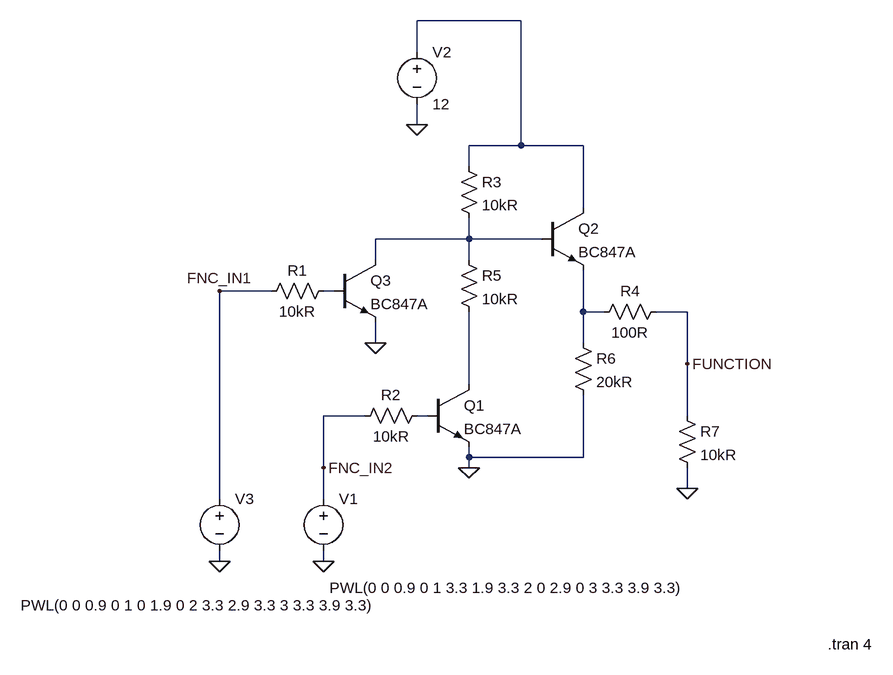
[diagram p0: schematic FUNCTION_output_circuit_ii.asc]
FUNCTION_output_circuit_ii.asc, the LTspice schematic file:
Version 4
SHEET 1 1620 784
WIRE 272 -192 112 -192
WIRE 112 -144 112 -192
WIRE 112 -32 112 -64
WIRE 272 0 272 -192
WIRE 272 0 192 0
WIRE 368 0 272 0
WIRE 192 32 192 0
WIRE 368 96 368 0
WIRE 192 144 192 112
WIRE 192 144 48 144
WIRE 304 144 192 144
WIRE 48 176 48 144
WIRE 192 176 192 144
WIRE -112 224 -192 224
WIRE -16 224 -32 224
WIRE 368 256 368 192
WIRE 400 256 368 256
WIRE 528 256 480 256
WIRE 48 304 48 272
WIRE 368 304 368 256
WIRE 528 336 528 256
WIRE 192 368 192 256
WIRE 32 416 -32 416
WIRE 128 416 112 416
WIRE 528 416 528 336
WIRE 192 480 192 464
WIRE 368 480 368 384
WIRE 368 480 192 480
WIRE -32 496 -32 416
WIRE 192 496 192 480
WIRE 528 528 528 496
WIRE -192 544 -192 224
WIRE -32 544 -32 496
WIRE -192 640 -192 624
WIRE -32 640 -32 624
FLAG 192 496 0
FLAG 112 -32 0
FLAG -192 224 FNC_IN1
FLAG -32 496 FNC_IN2
FLAG -192 640 0
FLAG -32 640 0
FLAG 528 336 FUNCTION
FLAG 528 528 0
FLAG 48 304 0
SYMBOL npn 128 368 R0
SYMATTR InstName Q1
SYMATTR Value BC847A
SYMBOL npn 304 96 R0
SYMATTR InstName Q2
SYMATTR Value BC847A
SYMBOL res -16 208 R90
WINDOW 0 0 56 VBottom 2
WINDOW 3 32 56 VTop 2
SYMATTR InstName R1
SYMATTR Value 10kR
SYMBOL res 128 400 R90
WINDOW 0 0 56 VBottom 2
WINDOW 3 32 56 VTop 2
SYMATTR InstName R2
SYMATTR Value 10kR
SYMBOL res 176 16 R0
SYMATTR InstName R3
SYMATTR Value 10kR
SYMBOL res 176 160 R0
SYMATTR InstName R5
SYMATTR Value 10kR
SYMBOL res 352 288 R0
SYMATTR InstName R6
SYMATTR Value 20kR
SYMBOL voltage 112 -160 R0
WINDOW 123 0 0 Left 0
WINDOW 39 0 0 Left 0
SYMATTR InstName V2
SYMATTR Value 12
SYMBOL voltage -192 528 R0
WINDOW 3 -306 180 Left 2
WINDOW 123 0 0 Left 0
WINDOW 39 0 0 Left 0
SYMATTR Value PWL(0 0 0.9 0 1 0 1.9 0 2 3.3 2.9 3.3 3 3.3 3.9 3.3)
SYMATTR InstName V3
SYMBOL voltage -32 528 R0
WINDOW 3 9 153 Left 2
WINDOW 123 0 0 Left 0
WINDOW 39 0 0 Left 0
SYMATTR Value PWL(0 0 0.9 0 1 3.3 1.9 3.3 2 0 2.9 0 3 3.3 3.9 3.3)
SYMATTR InstName V1
SYMBOL res 512 400 R0
SYMATTR InstName R7
SYMATTR Value 10kR
SYMBOL npn -16 176 R0
SYMATTR InstName Q3
SYMATTR Value BC847A
SYMBOL res 496 240 R90
WINDOW 0 0 56 VBottom 2
WINDOW 3 32 56 VTop 2
SYMATTR InstName R4
SYMATTR Value 100R
TEXT 744 768 Left 2 !.tran 4

The netlist it stands for:
* FUNCTION_output_circuit_ii.asc
Q1 N005 N006 0 0 BC847A
Q2 N001 N002 N004 0 BC847A
R1 N003 FNC_IN1 10kR
R2 N006 FNC_IN2 10kR
R3 N001 N002 10kR
R5 N002 N005 10kR
R6 N004 0 20kR
V2 N001 0 12
V3 FNC_IN1 0 PWL(0 0 0.9 0 1 0 1.9 0 2 3.3 2.9 3.3 3 3.3 3.9 3.3)
V1 FNC_IN2 0 PWL(0 0 0.9 0 1 3.3 1.9 3.3 2 0 2.9 0 3 3.3 3.9 3.3)
R7 FUNCTION 0 10kR
Q3 N002 N003 0 0 BC847A
R4 FUNCTION N004 100R
.model NPN NPN
.model PNP PNP
.lib standard.bjt
.tran 4
.backanno
.end